# Altium schematic sheet 5_ZeroCrossingDetector.SchDoc
size A4; SheetNumber: 7; SheetTotal: 7
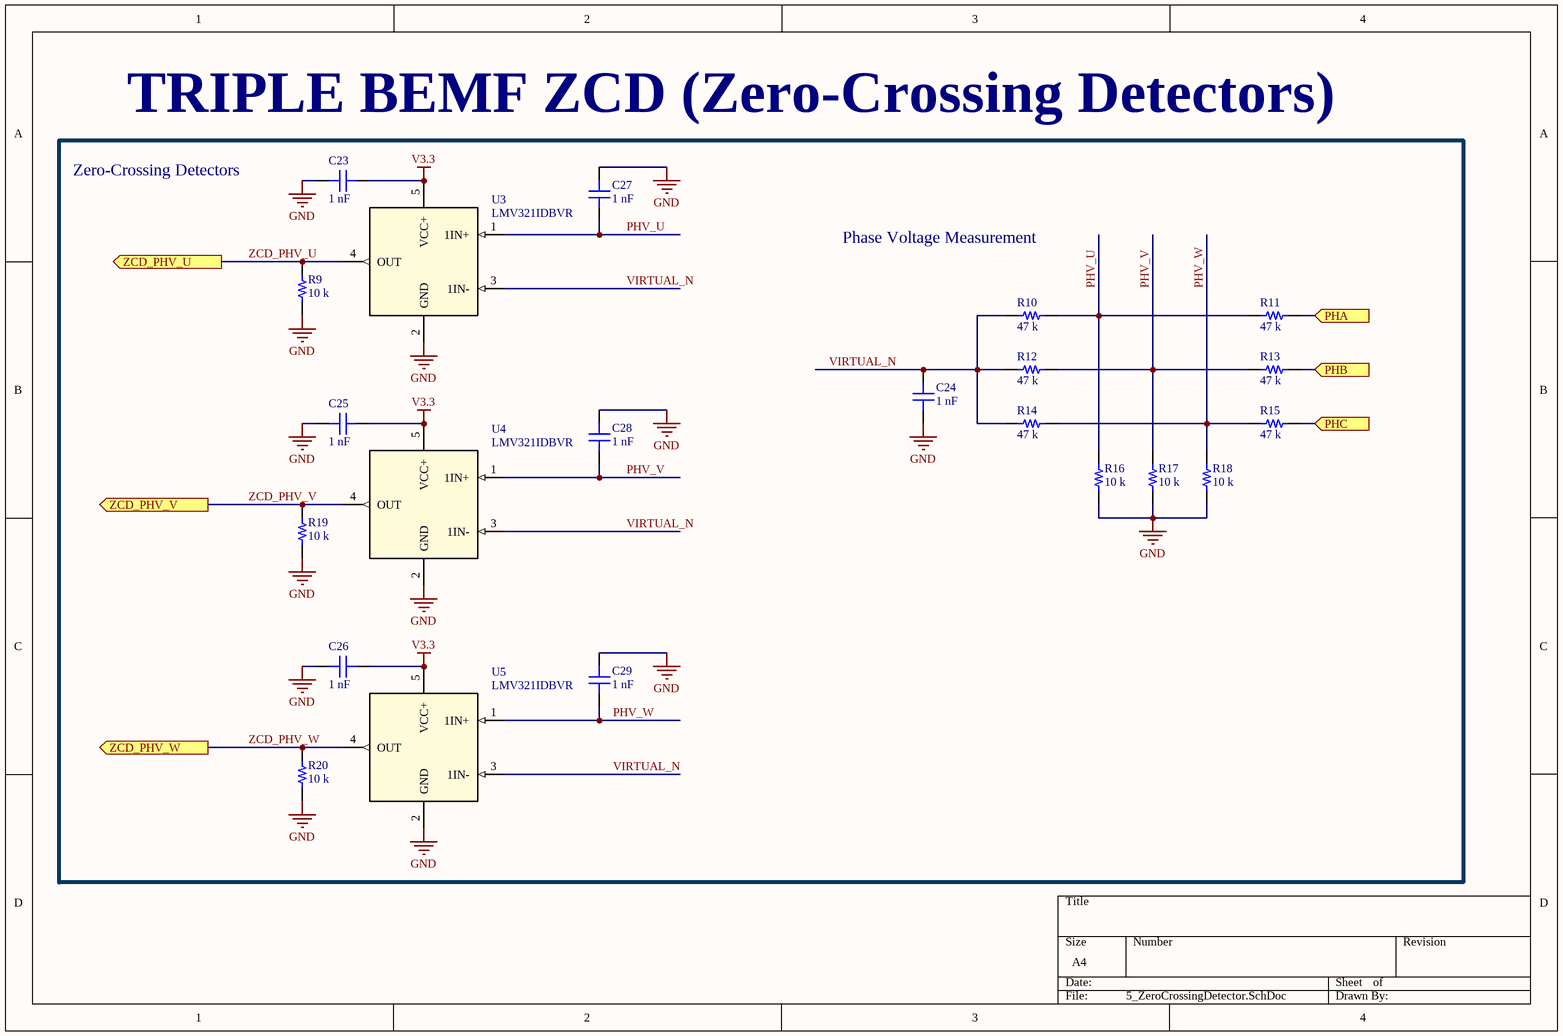
[diagram p0: 5_ZeroCrossingDetector.SchDoc]

## Parts
C23  1 nF  [CAP 0805_2012]
C24  1 nF  [CAP 0805_2012]
C25  1 nF  [CAP 0805_2012]
C26  1 nF  [CAP 0805_2012]
C27  1 nF  [CAP 0805_2012]
C28  1 nF  [CAP 0805_2012]
C29  1 nF  [CAP 0805_2012]
R9  10 k  [RES 0805_2012]
R10  47 k  [RES 0805_2012]
R11  47 k  [RES 0805_2012]
R12  47 k  [RES 0805_2012]
R13  47 k  [RES 0805_2012]
R14  47 k  [RES 0805_2012]
R15  47 k  [RES 0805_2012]
R16  10 k  [RES 0805_2012]
R17  10 k  [RES 0805_2012]
R18  10 k  [RES 0805_2012]
R19  10 k  [RES 0805_2012]
R20  10 k  [RES 0805_2012]
U3  LMV321IDBVR  [DBV5]
U4  LMV321IDBVR  [DBV5]
U5  LMV321IDBVR  [DBV5]

## Ports
PHA (in), PHB (in), PHC (in), ZCD_PHV_U (out), ZCD_PHV_V (out), ZCD_PHV_W (out)

## Nets
GND: C23.2 C24.1 C25.2 C26.2 C27.1 C28.1 C29.1 R9.2 R16.2 R17.2 R18.2 R19.2 R20.2 U3.2(GND) U4.2(GND) U5.2(GND)
V3.3: C23.1 C25.1 C26.1 U3.5(VCC+) U4.5(VCC+) U5.5(VCC+)
PHA: R11.1 ; port PHA
PHB: R13.1 ; port PHB
PHC: R15.1 ; port PHC
PHV_U: C27.2 R10.1 R11.2 R16.1 U3.1(1IN+)
PHV_V: C28.2 R12.1 R13.2 R17.1 U4.1(1IN+)
PHV_W: C29.2 R14.1 R15.2 R18.1 U5.1(1IN+)
VIRTUAL_N: C24.2 R10.2 R12.2 R14.2 U3.3(1IN-) U4.3(1IN-) U5.3(1IN-)
ZCD_PHV_U: R9.1 U3.4(OUT) ; port ZCD_PHV_U
ZCD_PHV_V: R19.1 U4.4(OUT) ; port ZCD_PHV_V
ZCD_PHV_W: R20.1 U5.4(OUT) ; port ZCD_PHV_W

## Notes on the sheet
- Zero-Crossing Detectors
- TRIPLE BEMF ZCD (Zero-Crossing Detectors)
- Phase Voltage Measurement

## Library data of the parts
C23-C29 = CC0805MRX7R9BB104: CAP CER 0.1UF 50V X7R 0805; manufacturer: Yageo; Capacitance: 0.1 µF; Tolerance: ±20%; Part Number: CC0805MRX7R9BB104; Value: 1 nF; Applications: General Purpose; componentlink1description: Datasheet; componentlink1url: https://www.yageo.com/upload/media/product/productsearch/datasheet/mlcc/UPY-GPHC_X7R_6.3V-to-50V_18.pdf; componentlink2description: DigiKey Link; componentlink2url: https://www.digikey.com/en/products/detail/yageo/CC0805MRX7R9BB104/5884281; Device Package: 0805 (2012 Metric); lastupdated: 15/11/2023 20:14:20; Lifecycle Status: Active; Minimum Order: 1; Mounting Type: Surface Mount, MLCC; Operating Temperature: -55°C ~ 125°C; Package / Case: 0805 (2012 Metric); packaging: TapeAndReel; partid: 2475; Part Status: Active; price: 0.01; series: CC; Size / Dimension: 0.079" L x 0.049" W (2.00mm x 1.25mm); Supplier 1: DigiKey; Supplier Part Number 1: 311-4351-1-ND; Temperature Coefficient: X7R; Thickness (Max): 0.037" (0.95mm); Voltage - Rated: 50V
R9-R20 = CR0805-JW-204ELF: RES SMD 200K OHM 5% 1/8W 0805; Manufacturer: Bourns Inc.; Power (Watts): 0.125W, 1/8W; Resistance: 200 kOhms; Temperature Coefficient: ±200ppm/°C; Part Number: CR0805-JW-204ELF; ComponentLink1Description: Datasheet; ComponentLink1URL: https://www.bourns.com/docs/product-datasheets/cr.pdf?sfvrsn=574d41f6_14; ComponentLink2Description: DigiKey Link; ComponentLink2URL: https://www.digikey.com/en/products/detail/bourns-inc/CR0805-JW-204ELF/3785267; Composition: Thick Film; Device Package: 0805 (2012 Metric); Features: Moisture Resistant; Height - Seated (Max): 0.024" (0.60mm); LastUpdated: 02/11/2023 20:02:13; Lifecycle Status: Active; Minimum Order: 1; Number of Terminations: 2; Operating Temperature: -55°C ~ 155°C; Package / Case: 0805 (2012 Metric); Packaging: TapeAndReel; PartId: 69673; Part Status: Active; Price: 0.01; Series: CR0805; Size / Dimension: 0.079" L x 0.049" W (2.00mm x 1.25mm); Supplier 1: DigiKey; Supplier Part Number 1: 118-CR0805-JW-204ELFCT-ND; Supplier Device Package: 0805; Tolerance: ±5%
  R9 R16-R20: Value: 10 k
  R10-R15: Value: 47 k
U3-U5 = LMV321IDBVR: No Description Available; Mfr_Name: Texas Instruments; Copyright: Copyright (C) 2023 Ultra Librarian. All rights reserved.; Manufacturer_Part_Number: LMV321IDBVR; RefDes: RefDes; Type: DEV